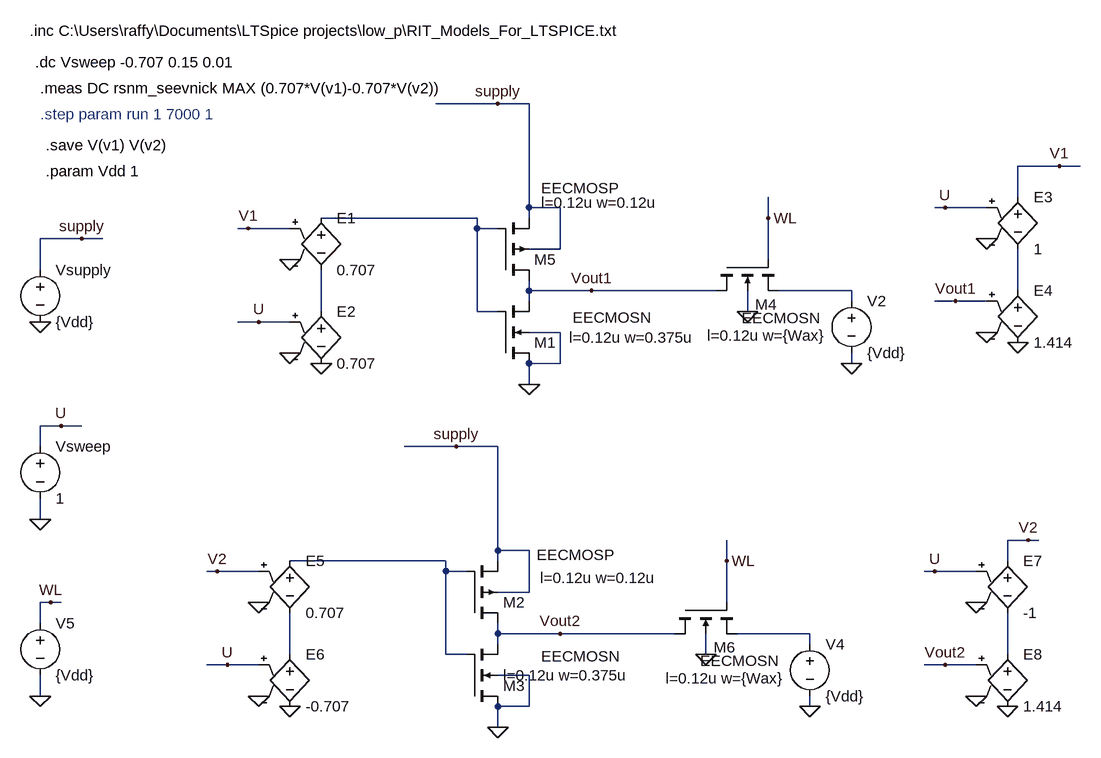
[diagram p0: schematic seevnick_read.asc]
seevnick_read.asc, the LTspice schematic file:
Version 4
SHEET 1 1380 1108
WIRE 128 128 32 128
WIRE 176 128 128 128
WIRE 992 224 928 224
WIRE 1024 224 992 224
WIRE 928 272 928 224
WIRE 176 288 176 128
WIRE 224 288 176 288
WIRE 816 288 800 288
WIRE 880 288 816 288
WIRE 96 304 -144 304
WIRE 176 304 176 288
WIRE 544 304 544 272
WIRE -256 320 -272 320
WIRE -192 320 -256 320
WIRE 96 320 96 304
WIRE 128 320 96 320
WIRE -512 336 -576 336
WIRE -480 336 -512 336
WIRE 224 352 224 288
WIRE 224 352 176 352
WIRE 544 368 544 304
WIRE -576 384 -576 336
WIRE 176 416 176 400
WIRE 272 416 176 416
WIRE 464 416 272 416
WIRE 672 416 560 416
WIRE 928 416 928 352
WIRE 176 432 176 416
WIRE 672 432 672 416
WIRE 832 432 800 432
WIRE 880 432 832 432
WIRE -144 448 -144 384
WIRE 96 448 96 320
WIRE 128 448 96 448
WIRE 512 448 512 416
WIRE -240 464 -272 464
WIRE -192 464 -240 464
WIRE 224 480 176 480
WIRE 224 528 224 480
WIRE 224 528 176 528
WIRE 672 528 672 512
WIRE 176 560 176 528
WIRE -544 624 -576 624
WIRE -512 624 -544 624
WIRE -576 656 -576 624
WIRE 64 656 -16 656
WIRE 128 656 64 656
WIRE -576 768 -576 736
WIRE 944 800 912 800
WIRE 960 800 944 800
WIRE 128 816 128 656
WIRE 176 816 128 816
WIRE 48 832 -192 832
WIRE 128 832 128 816
WIRE 480 832 480 800
WIRE 912 832 912 800
WIRE -304 848 -320 848
WIRE -240 848 -304 848
WIRE 48 848 48 832
WIRE 80 848 48 848
WIRE 800 848 784 848
WIRE 864 848 800 848
WIRE 176 880 176 816
WIRE 176 880 128 880
WIRE -560 896 -576 896
WIRE -544 896 -560 896
WIRE 480 896 480 832
WIRE -576 928 -576 896
WIRE 128 944 128 928
WIRE 224 944 128 944
WIRE 400 944 224 944
WIRE 608 944 496 944
WIRE 128 960 128 944
WIRE 608 960 608 944
WIRE -192 976 -192 912
WIRE 48 976 48 848
WIRE 80 976 48 976
WIRE 448 976 448 944
WIRE 912 976 912 912
WIRE -288 992 -320 992
WIRE -240 992 -288 992
WIRE 816 992 784 992
WIRE 864 992 816 992
WIRE 176 1008 128 1008
WIRE -576 1040 -576 1008
WIRE 176 1056 176 1008
WIRE 176 1056 128 1056
WIRE 608 1056 608 1040
WIRE 128 1088 128 1056
FLAG -576 768 0
FLAG -544 624 U
FLAG 176 560 0
FLAG 272 416 Vout1
FLAG -192 368 0
FLAG -240 464 U
FLAG -192 512 0
FLAG -144 528 0
FLAG 880 336 0
FLAG 832 432 Vout1
FLAG 880 480 0
FLAG 928 496 0
FLAG 816 288 U
FLAG 128 1088 0
FLAG 224 944 Vout2
FLAG -240 896 0
FLAG -288 992 U
FLAG -240 1040 0
FLAG -192 1056 0
FLAG 864 896 0
FLAG 816 992 Vout2
FLAG 864 1040 0
FLAG 912 1056 0
FLAG 800 848 U
FLAG -304 848 V2
FLAG -256 320 V1
FLAG 992 224 V1
FLAG 944 800 V2
FLAG 512 448 0
FLAG 672 528 0
FLAG 544 304 WL
FLAG 448 976 0
FLAG 608 1056 0
FLAG 480 832 WL
FLAG -576 1040 0
FLAG -560 896 WL
FLAG -576 464 0
FLAG -512 336 supply
FLAG 128 128 supply
FLAG 64 656 supply
SYMBOL voltage -576 640 R0
WINDOW 123 0 0 Left 0
WINDOW 39 0 0 Left 0
SYMATTR InstName Vsweep
SYMATTR Value 1
SYMBOL pmos4 128 400 M180
WINDOW 3 67 142 Left 2
WINDOW 123 67 120 Left 2
SYMATTR Value EECMOSP
SYMATTR Value2 l=0.12u w=0.12u
SYMATTR InstName M5
SYMBOL nmos4 128 528 M180
WINDOW 3 115 71 Left 2
WINDOW 123 110 40 Left 2
SYMATTR Value EECMOSN
SYMATTR Value2 l=0.12u w=0.375u
SYMATTR InstName M1
SYMBOL e -144 288 R0
SYMATTR InstName E1
SYMATTR Value 0.707
SYMBOL e -144 432 R0
SYMATTR InstName E2
SYMATTR Value 0.707
SYMBOL e 928 256 R0
SYMATTR InstName E3
SYMATTR Value 1
SYMBOL e 928 400 R0
SYMATTR InstName E4
SYMATTR Value 1.414
SYMBOL pmos4 80 928 M180
WINDOW 3 108 105 Left 2
WINDOW 123 113 70 Left 2
SYMATTR Value EECMOSP
SYMATTR Value2 l=0.12u w=0.12u
SYMATTR InstName M2
SYMBOL nmos4 80 1056 M180
WINDOW 3 115 77 Left 2
WINDOW 123 56 48 Left 2
SYMATTR Value EECMOSN
SYMATTR Value2 l=0.12u w=0.375u
SYMATTR InstName M3
SYMBOL e -192 816 R0
SYMATTR InstName E5
SYMATTR Value 0.707
SYMBOL e -192 960 R0
SYMATTR InstName E6
SYMATTR Value -0.707
SYMBOL e 912 816 R0
SYMATTR InstName E7
SYMATTR Value -1
SYMBOL e 912 960 R0
SYMATTR InstName E8
SYMATTR Value 1.414
SYMBOL nmos4 464 368 M90
WINDOW 0 69 94 VLeft 2
WINDOW 3 90 160 VLeft 2
WINDOW 123 117 169 VLeft 2
SYMATTR InstName M4
SYMATTR Value EECMOSN
SYMATTR Value2 l=0.12u w={Wax}
SYMBOL voltage 672 416 R0
WINDOW 123 0 0 Left 0
WINDOW 39 0 0 Left 0
SYMATTR InstName V2
SYMATTR Value {Vdd}
SYMBOL nmos4 400 896 M90
WINDOW 0 69 94 VLeft 2
WINDOW 3 90 160 VLeft 2
WINDOW 123 117 169 VLeft 2
SYMATTR InstName M6
SYMATTR Value EECMOSN
SYMATTR Value2 l=0.12u w={Wax}
SYMBOL voltage 608 944 R0
WINDOW 123 0 0 Left 0
WINDOW 39 0 0 Left 0
SYMATTR InstName V4
SYMATTR Value {Vdd}
SYMBOL voltage -576 912 R0
WINDOW 123 0 0 Left 0
WINDOW 39 0 0 Left 0
SYMATTR InstName V5
SYMATTR Value {Vdd}
SYMBOL voltage -576 368 R0
WINDOW 123 0 0 Left 0
WINDOW 39 0 0 Left 0
SYMATTR InstName Vsupply
SYMATTR Value {Vdd}
TEXT -592 16 Left 2 !.inc C:\\Users\\raffy\\Documents\\LTSpice projects\\low_p\\RIT_Models_For_LTSPICE.txt
TEXT -584 64 Left 2 !.dc Vsweep -0.707 0.15 0.01
TEXT -576 104 Left 2 !.meas DC rsnm_seevnick MAX (0.707*V(v1)-0.707*V(v2))
TEXT -576 144 Left 2 ;.step param run 1 7000 1
TEXT -568 192 Left 2 !.save V(v1) V(v2)
TEXT -568 232 Left 2 !.param Vdd 1

The netlist it stands for:
* seevnick_read.asc
Vsweep U 0 1
M5 Vout1 N001 supply supply EECMOSP l=0.12u w=0.12u
M1 0 N001 Vout1 0 EECMOSN l=0.12u w=0.375u
E1 N001 N004 V1 0 0.707
E2 N004 0 U 0 0.707
E3 V1 N003 U 0 1
E4 N003 0 Vout1 0 1.414
M2 Vout2 N005 supply supply EECMOSP l=0.12u w=0.12u
M3 0 N005 Vout2 0 EECMOSN l=0.12u w=0.375u
E5 N005 N007 V2 0 0.707
E6 N007 0 U 0 -0.707
E7 V2 N008 U 0 -1
E8 N008 0 Vout2 0 1.414
M4 Vout1 WL N002 0 EECMOSN l=0.12u w={Wax}
V2 N002 0 {Vdd}
M6 Vout2 WL N006 0 EECMOSN l=0.12u w={Wax}
V4 N006 0 {Vdd}
V5 WL 0 {Vdd}
Vsupply supply 0 {Vdd}
.model NMOS NMOS
.model PMOS PMOS
.lib standard.mos
.inc C:\Users\raffy\Documents\LTSpice projects\low_p\RIT_Models_For_LTSPICE.txt
.dc Vsweep -0.707 0.15 0.01
.meas DC rsnm_seevnick MAX (0.707*V(v1)-0.707*V(v2))
* .step param run 1 7000 1
.save V(v1) V(v2)
.param Vdd 1
.backanno
.end